# Altium schematic sheet Oscillator Core.SchDoc
size A; SheetNumber: 4; SheetTotal: 4
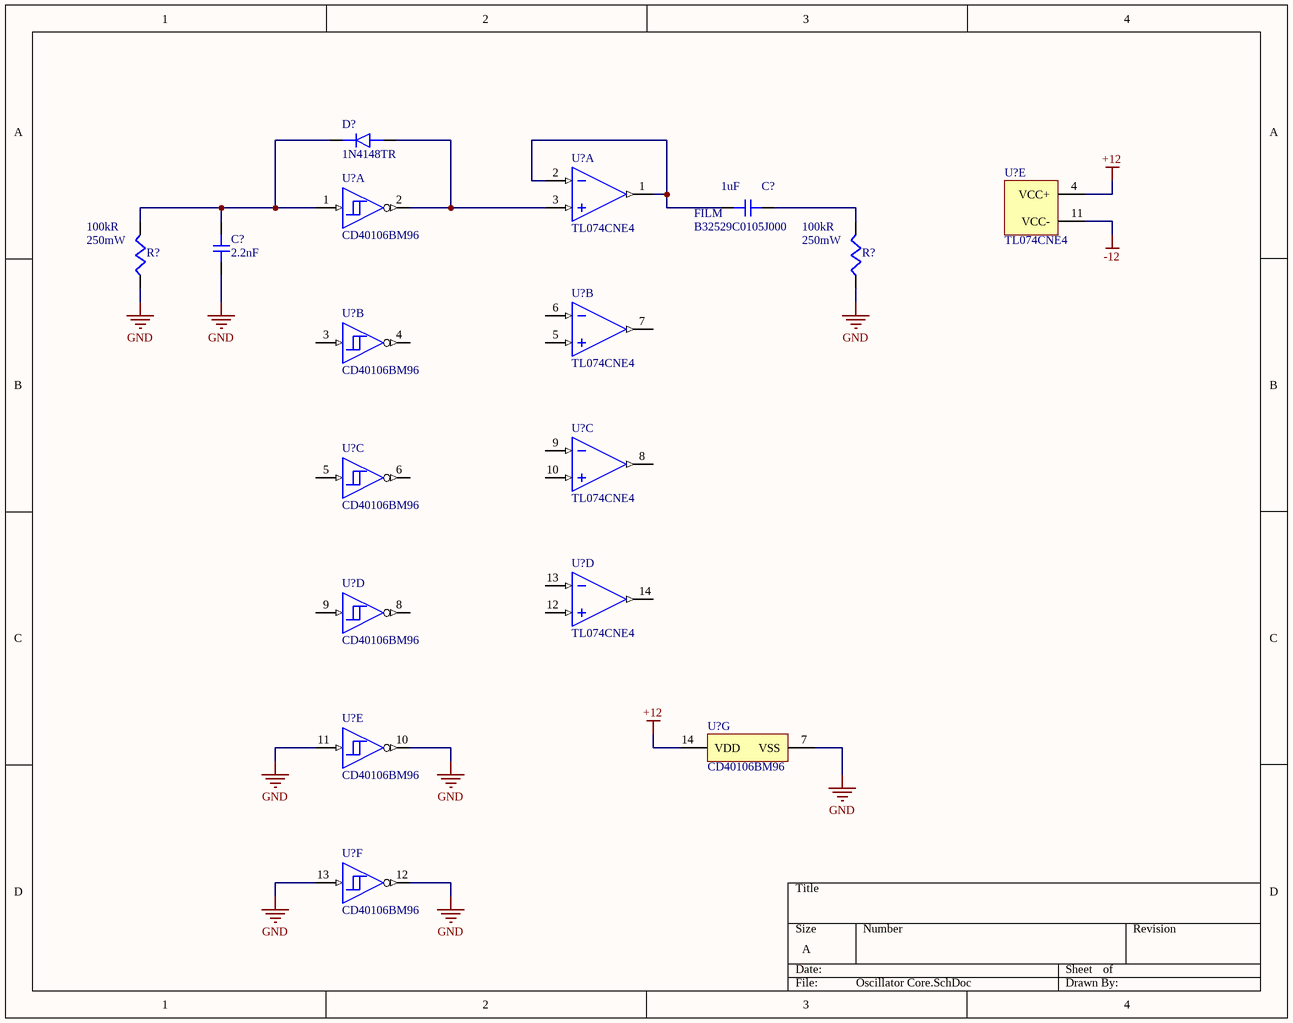
[diagram p0: Oscillator Core.SchDoc]

## Parts
(Parts that share a designator on the sheet are numbered #1, #2 ... from top to bottom, then left to right.)
C?#1  value 1uF  Manufacturer Part Number: B32529C0105J000  Capacitor Type: FILM  [0201-CAP]  (hidden comment: Ceramic Capacitor)
C?#2  value 2.2nF  [Cap Radial - PHE850EA4220MA01R17]  (hidden comment: Ceramic Capacitor)
D?  1N4148TR  [Diode 1N4148TR]
R?#1  value 100kR  Power: 250mW  [AXIAL - 07.4mm Length]  (hidden comment: Res)
R?#2  value 100kR  Power: 250mW  [AXIAL - 07.4mm Length]  (hidden comment: Res)
U?#1  TL074CNE4  [TL074CN]  (part A of 5)
U?#2  CD40106BM96  [CD40106BM96]  (part A of 7)
U?#3  TL074CNE4  [TL074CN]  (part E of 5)
U?#4  TL074CNE4  [TL074CN]  (part B of 5)
U?#5  CD40106BM96  [CD40106BM96]  (part B of 7)
U?#6  TL074CNE4  [TL074CN]  (part C of 5)
U?#7  CD40106BM96  [CD40106BM96]  (part C of 7)
U?#8  TL074CNE4  [TL074CN]  (part D of 5)
U?#9  CD40106BM96  [CD40106BM96]  (part D of 7)
U?#10  CD40106BM96  [CD40106BM96]  (part E of 7)
U?#11  CD40106BM96  [CD40106BM96]  (part G of 7)
U?#12  CD40106BM96  [CD40106BM96]  (part F of 7)

## Nets
+12: U?#3.4(VCC+) U?#11.14(VDD)
-12: U?#3.11(VCC-)
GND: C?#2.1 R?#1.2 R?#2.2 U?#10.10(K=~{E}) U?#10.11(E) U?#11.7(VSS) U?#12.12(L=~{F}) U?#12.13(F)
NetC?#1_1: C?#1.1 U?#1.1(OUT1) U?#1.2(IN1-)
NetC?#1_2: C?#1.2 R?#2.1
NetC?#2_2: C?#2.2 D?.1(C) R?#1.1 U?#2.1(A)
NetD?_2: D?.2(A) U?#1.3(IN1+) U?#2.2(G=~{A})

Not connected (* = marked no-connect by the designer): U?#4 5(IN2+) 6(IN2-) 7(OUT2); U?#5 3(B) 4(H=~{B}); U?#6 8(OUT3) 9(IN3-) 10(IN3+); U?#7 5(C) 6(I=~{C}); U?#8 12(IN4+) 13(IN4-) 14(OUT4); U?#9 8(J=~{D}) 9(D)

## Library data of the parts
C?#1 = Cap: Film Capacitor, Polyester And Polyethylene Terephthalate, 63V, 5% +Tol, 5% -Tol, 1uF, Through Hole Mount; Manufacturer: TDK EPCOS; Rated AC Voltage (URac): 40V; Supplier: Arrow Electronics; Supplier Part Number: B32529C0105J000; RoHS: Yes; Category: Film Capacitors; Stock: 6189; Pricing: 1=0.185, 10=0.1831, 50=0.1813, 100=0.1795, 500=0.1711, 1500=0.1699, 3000=0.1637, 6000=0.1625 (USD); Mounting Technology: Through Hole; Pins: 2; Dielectric Material: Polyester; Package Shape: Rectangular; Case/Package: 2918; Terminal Finish: Tin; Min Operating Temperature: -55°C; Max Operating Temperature: 85°C; JESD-609 Code: e3; Tolerance  (fill in as +-): 5%; Package Style: RadialMeter; Packaging: Bulk; Tolerance (fill in as +-): 5%; Rated DC Voltage (URdc): 63V; Termination: Wire; Length: 7.3mm; Width: 4.5mm; Height: 9.5mm; Terminal Pitch: 5mm; Reach SVHC Compliant: Yes; RoHS Compliant: Yes; ComponentLink1URL: https://datasheet.ciiva.com:443/pdfs/VipMasterIC/IC/TDKC/TDKC-S-A0008208241/TDKC-S-A0008208241-1.pdf?src-supplier=IHS+Markit; ComponentLink1Description: https://datasheet.ciiva.com:443/pdfs/VipMasterIC/IC/TDKC/TDKC-S-A0008208241/TDKC-S-A0008208241-1.pdf?src-supplier=IHS+Markit; ComponentLink2URL: https://datasheet.ciiva.com/48779/1756148-48779390.pdf?src-supplier=Element14; ComponentLink2Description: https://datasheet.ciiva.com/48779/1756148-48779390.pdf?src-supplier=Element14
C?#2 = Cap Film - PHE850EA4220MA01R17: Film Capacitor, Polypropylene, 1250V, 20% +Tol, 20% -Tol, 0.0022uF, Through Hole Mount, 5116; Manufacturer: KEMET; Rated AC Voltage (URac): 300V; Rated DC Voltage (URdc): 1.25kV; Supplier: Digikey; Supplier Part Number: 399-5416-ND; Manufacturer Part Number: PHE850EA4220MA01R17; RoHS: Yes; Category: Film Capacitors; Stock: 9606; Pricing: 1=0.55, 10=0.37, 50=0.2944, 100=0.243, 500=0.18988, 1000=0.1614, 3000=0.1519, 5000=0.14241 (USD); Mounting Technology: Through Hole; Pins: 2; Dielectric Material: Polypropylene; Package Shape: Rectangular; Case/Package: 5116; Min Operating Temperature: -55°C; Max Operating Temperature: 110°C; Capacitor Type: FILM; Tolerance  (fill in as +-): 20%; Package Style: RadialMeter; Packaging: Bulk; Tolerance (fill in as +-): 20%; Termination: Wire; Length: 13mm; Width: 4mm; Height: 9mm; Terminal Pitch: 10mm; Reach SVHC Compliant: Yes; RoHS Compliant: Yes; ComponentLink1URL: http://capacitoredge.kemet.com:80/capedge2/DataSheet/Datasheet-F850AG222M300A.pdf?pn=F850AG222M300A&src-supplier=IHS+Markit; ComponentLink1Description: http://capacitoredge.kemet.com:80/capedge2/DataSheet/Datasheet-F850AG222M300A.pdf?pn=F850AG222M300A&src-supplier=IHS+Markit; ComponentLink2URL: https://datasheet.ciiva.com/11791/0900766b807a221a-11791184.pdf?src-supplier=Rs; ComponentLink2Description: https://datasheet.ciiva.com/11791/0900766b807a221a-11791184.pdf?src-supplier=Rs; ComponentLink3URL: https://datasheet.ciiva.com/26822/getdatasheetpartid-292550-26822588.pdf?src-supplier=Verical; ComponentLink3Description: https://datasheet.ciiva.com/26822/getdatasheetpartid-292550-26822588.pdf?src-supplier=Verical; ComponentLink4URL: https://datasheet.ciiva.com/241/f3294-phe850-241384.pdf?src-supplier=Digikey; ComponentLink4Description: https://datasheet.ciiva.com/241/f3294-phe850-241384.pdf?src-supplier=Digikey; ComponentLink5URL: https://datasheet.ciiva.com/8031/629954-8031387.pdf?src-supplier=Element14; ComponentLink5Description: https://datasheet.ciiva.com/8031/629954-8031387.pdf?src-supplier=Element14; ComponentLink6URL: https://datasheet.ciiva.com/14111/bbphe850-data-e-14111198.pdf?src-supplier=Distrelec; ComponentLink6Description: https://datasheet.ciiva.com/14111/bbphe850-data-e-14111198.pdf?src-supplier=Distrelec
D? = Diode 1N4148TR: DIODE GEN PURP 100V 200MA DO35; Manufacturer: ON Semiconductor; Peak Reverse Current: 5uA; Value: 4pF; Max Junction Temp: +175°C; Max Surge Forward Current: 1A; Footprint Url: https://www.onsemi.com/pub/Collateral/017AG.PDF; Temperature Range Low: -55°C; Max Repetitive Reverse Voltage: 100V; Temperature Range High: +175°C; Reverse Voltage: 100V; ComponentLink2URL: https://www.onsemi.com/pub/Collateral/1N914A-D.pdf; Category: Diode; Package: 017AG; Octopart: https://octopart.com/1n4148tr-on+semiconductor-84323125; Device Class L1: Discrete Semiconductors; Manufacturer Part Number: 1N4148TR; Forward Current: 200mA; Temperature: -55°C to +175°C; Lead Free: Yes; Digikey Description: DIODE GEN PURP 100V 200MA DO35; Mouser Description: 1N4148 Series 100 V 500 mW Small Signal Fast Switching Diode - DO-35; Automotive: No; Device Class L2: Diodes; Device Class L3: Rectifier Diodes; Height: 1.91mm; ComponentLink2Description: Datasheet; RoHS: TRUE; Capacitance: 4pF
R?#1 R?#2 = Res: Fixed Resistor, Metal Film, 0.25W, 100000ohm, 250V, 0.1% +/-Tol, 25ppm/Cel, Through Hole Mount; Manufacturer: Stackpole Electronics; Manufacturer Part Number: RNF14BTE100K; Additional Feature: FLAME PROOF; Rated Temperature: 70°C; Temperature Coefficient: 25ppm/°C; Lead Diameter: 0.56mm; Package Diameter: 2.35mm; Package Length: 6.35mm; Supplier: Arrow Electronics; Supplier Part Number: RNF14BTE100K; RoHS: Yes; Category: Through-Hole Resistors; Stock: 4170; Pricing: 706=0.1448, 1000=0.1429, 3000=0.1409 (USD); Mounting Technology: Through Hole; Pins: 2; Terminal Finish: Tin; Min Operating Temperature: -55°C; Max Operating Temperature: 155°C; Tolerance: 0.1%; JESD-609 Code: e3; Resistor Type: FIXED RESISTOR; Construction: Tubular; Package Style: AxialMeter; Packaging: Tape and Reel; Technology: METAL FILM; Termination: Wire; Working Voltage: 250V; Reach SVHC Compliant: Yes; RoHS Compliant: Yes; ComponentLink1URL: https://datasheet.ciiva.com:443/pdfs/VipMasterIC/IC/SEIE/SEIE-S-A0004433080/SEIE-S-A0004433080-1.pdf?src-supplier=IHS+Markit; ComponentLink1Description: https://datasheet.ciiva.com:443/pdfs/VipMasterIC/IC/SEIE/SEIE-S-A0004433080/SEIE-S-A0004433080-1.pdf?src-supplier=IHS+Markit; ComponentLink2URL: https://www.seielect.com/catalog/SEI-Packaging.pdf?src-supplier=Digikey; ComponentLink2Description: https://www.seielect.com/catalog/SEI-Packaging.pdf?src-supplier=Digikey; ComponentLink3URL: https://www.seielect.com/Catalog/SEI-RNF_RNMF.pdf?src-supplier=Avnet; ComponentLink3Description: https://www.seielect.com/Catalog/SEI-RNF_RNMF.pdf?src-supplier=Avnet; ComponentLink4URL: https://datasheet.octopart.com/RNF14BTE100K-Stackpole-Electronics-datasheet-12510179.pdf?src-supplier=Future+Electronics; ComponentLink4Description: https://datasheet.octopart.com/RNF14BTE100K-Stackpole-Electronics-datasheet-12510179.pdf?src-supplier=Future+Electronics
U?#1 U?#3 U?#4 U?#6 U?#8 = TL074CN: Quad Low-Noise JFET-Input General-Purpose Operational Amplifier, 7 to 36 V, 0 to 70 degC, 14-pin DIP (N14), Pb-Free (RoHS); Manufacturer: Texas Instruments; Iq per channel(Max)(mA): 2.5; Total Supply Voltage(Max)(+5V is 5, +/-5V is 10): 36; GBW(Typ)(MHz): 3; Number of Channels: 4; Sub Family: General Purpose Amplifier, High Supply Voltage Amplifier (>=30V); CMRR(Min)(dB): 70; Slew Rate(Typ)(V/us): 13; IIB(Max)(pA): 200; Offset Drift(Typ)(uV/C): 18; Rating: Military; Vio (25C)(Max)(mV): 10; Total Supply Voltage(Min)(+5V is 5, +/-5V is 10): 7; PackageVersion: 4040049/E, 12/2002; DatasheetVersion: SLOS080J; Code_JEDEC: MS-001; PackageReference: N14; ComponentLink1Description: Manufacturer URL; Mounting Technology: Through Hole; PartNumber: TL074CNE4; ComponentLink2URL: http://www.ti.com/lit/ds/symlink/tl074.pdf; ComponentLink1URL: http://www.ti.com/; PackageDescription: 14-Pin Plastic In-Line, Body 19.305 x 6.35 mm, Pitch 2.54 mm; ComponentLink2Description: Datasheet; Eco-Plan: Pb-Free (RoHS); Vn at 1kHz(Typ)(nV/rtHz): 18; ComponentLink3URL: http://www.ti.com/lit/ml/mpdi002c/mpdi002c.pdf; ComponentLink3Description: Package Specification
U?#2 U?#5 U?#7 U?#9-U?#12 = CD40106 Schmitt Trigger: CMOS Hex Schmitt Triggers, D0014A, LARGE T&R; Manufacturer: Texas Instruments; Technology Family: CD4000; Voltage(Nom)(V): 5; ICC @ Nom Voltage(Max)(mA): 0.03; tpd @ Nom Voltage(Max)(ns): 280; Rating: Catalog; Schmitt Trigger: Yes; Output Drive (IOL/IOH)(Max)(mA): -1/1; VCC(Max)(V): 18; F @ Nom Voltage(Max)(Mhz): 12; Bits(#): 6; VCC(Min)(V): 3; Code_JEDEC: MS-012; PackageReference: D0014A; Output Type: CMOS; Generic Part Number: CD40106B; Operating Temperature Range(C): -55 to 125; Input Type: CMOS; DatasheetVersion: SCHS097D